# Altium schematic sheet Sheet1.SchDoc
size A1; SheetNumber: 1; SheetTotal: 1
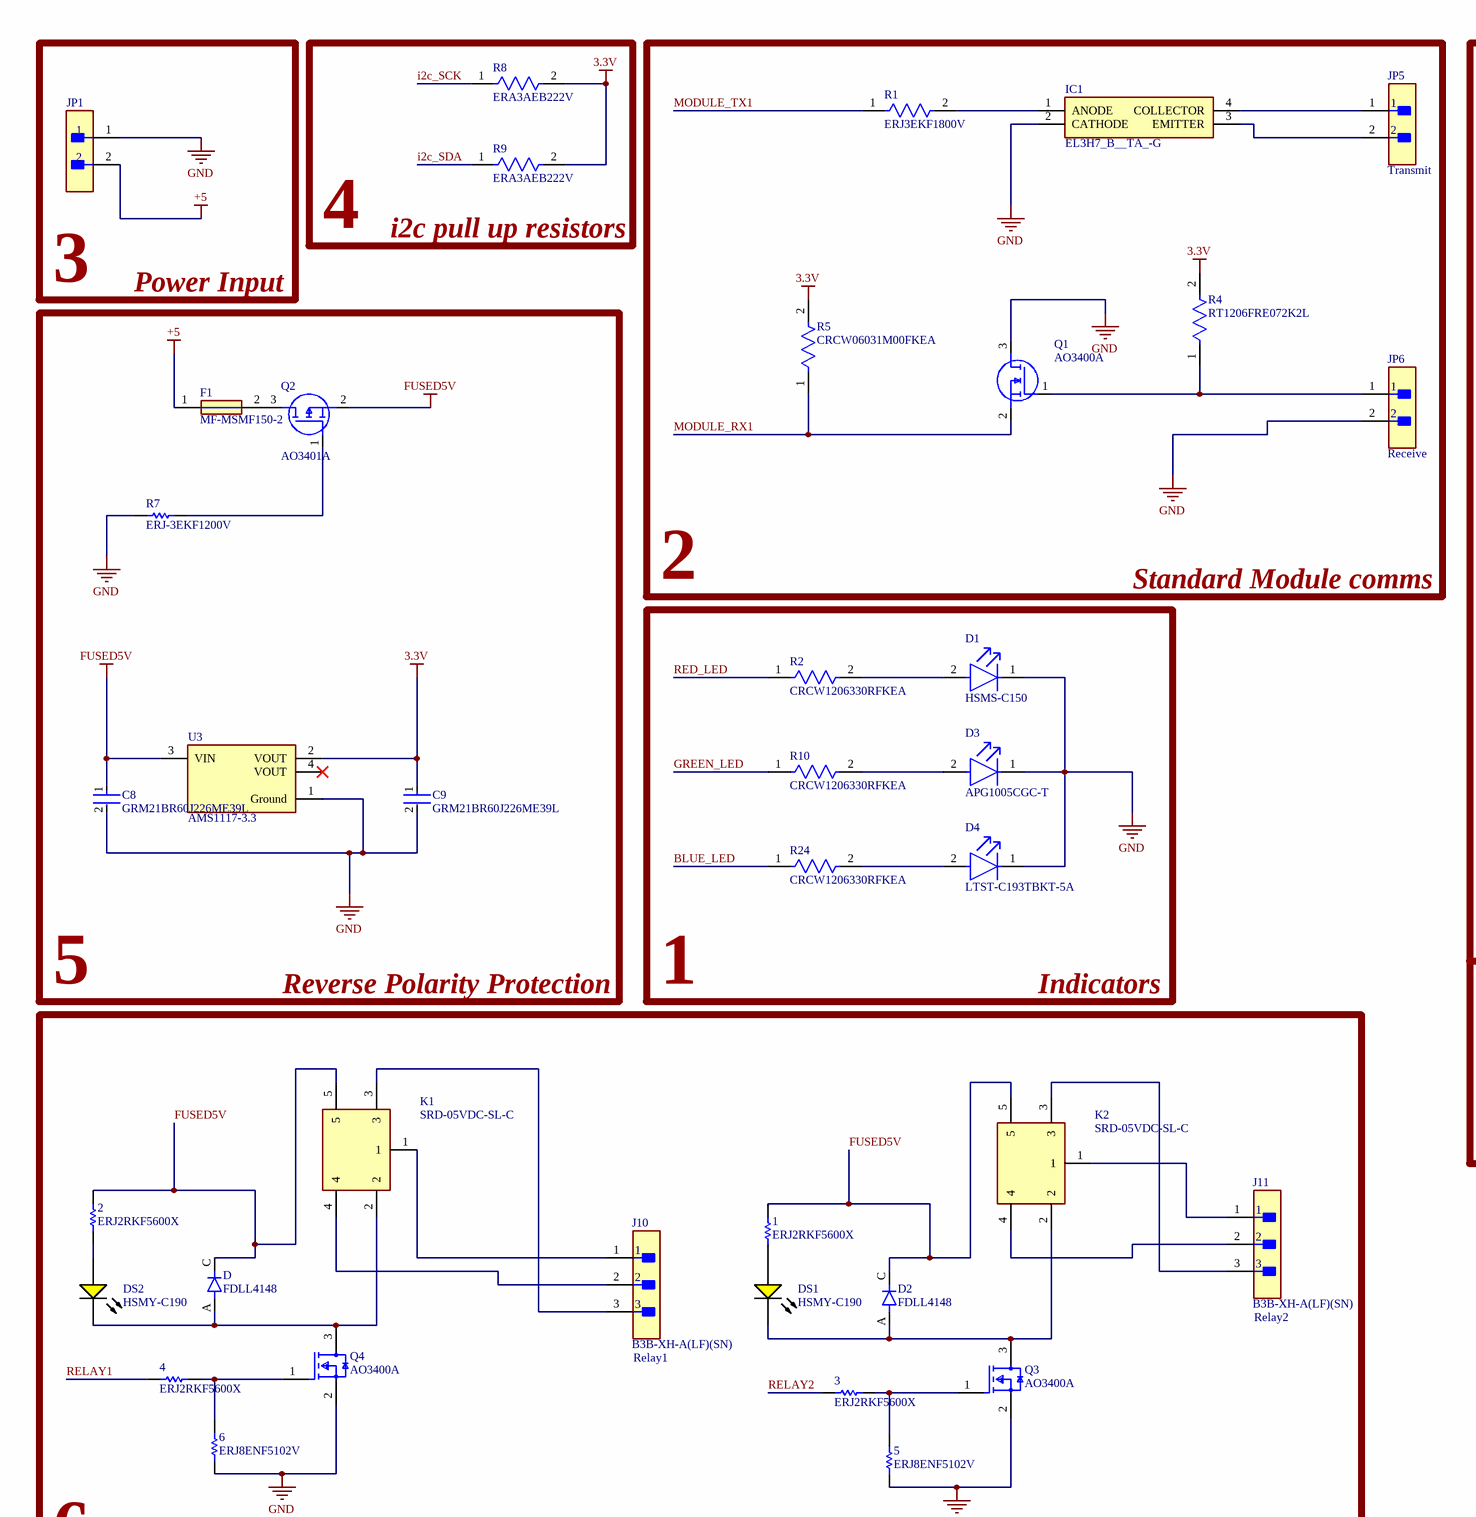
[diagram p0: Sheet1.SchDoc, top left]
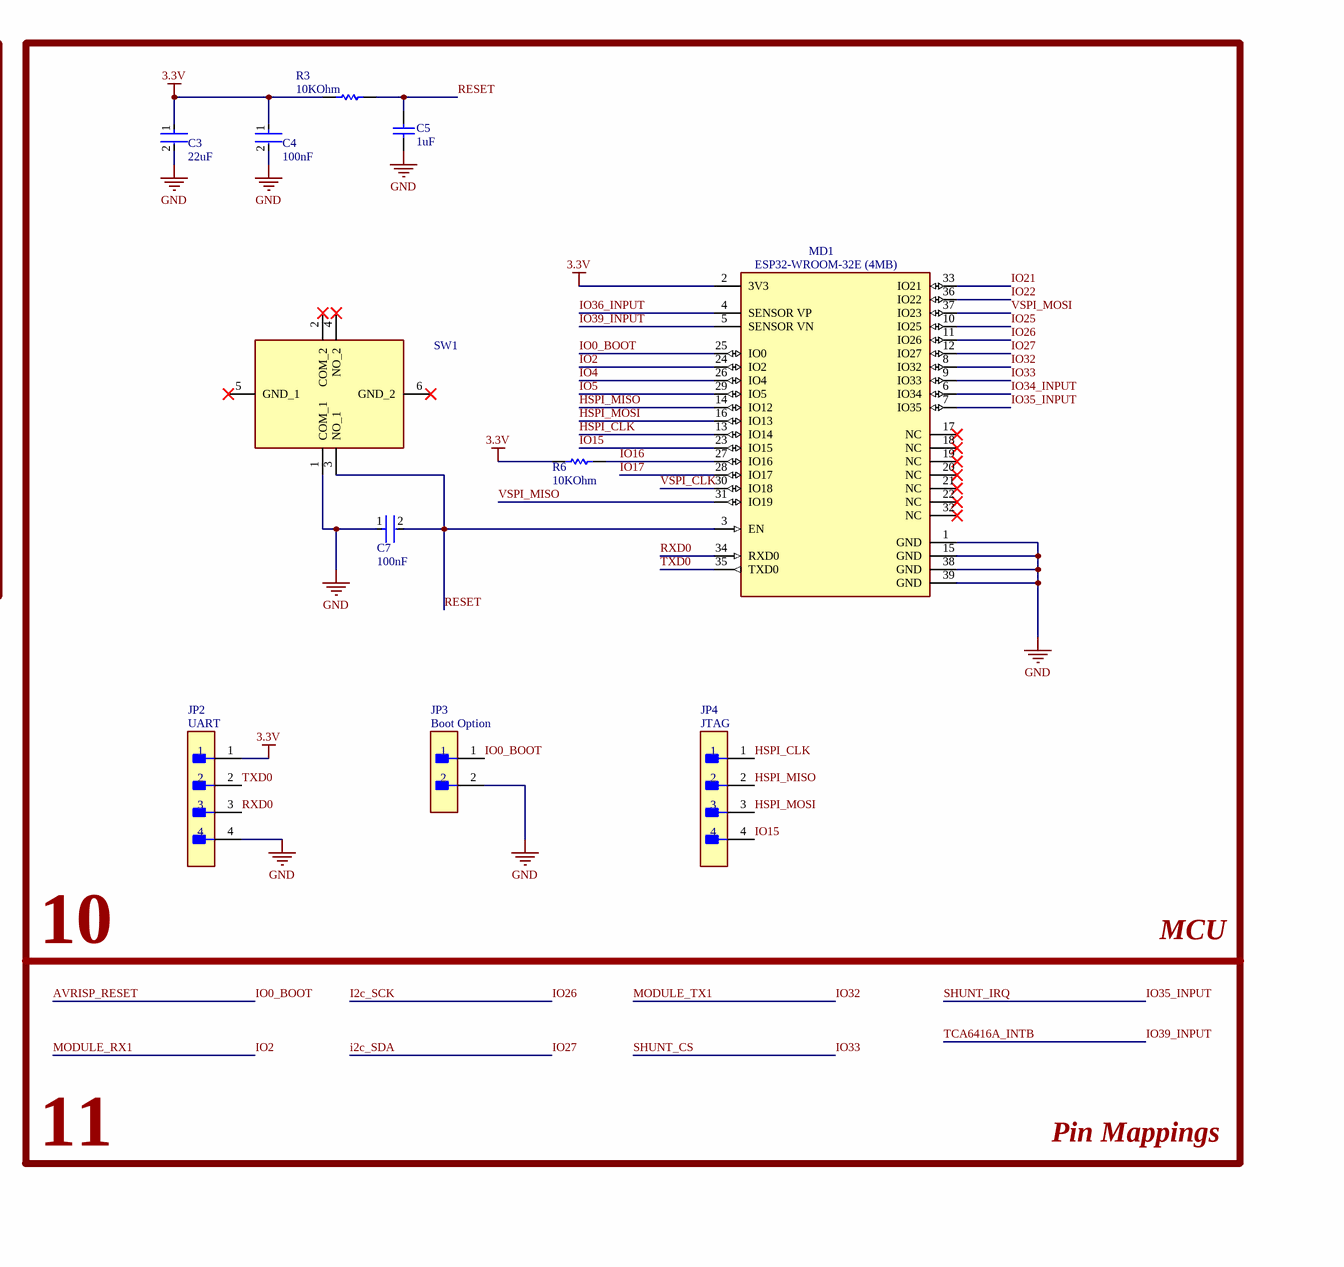
[diagram p1: Sheet1.SchDoc, top right]
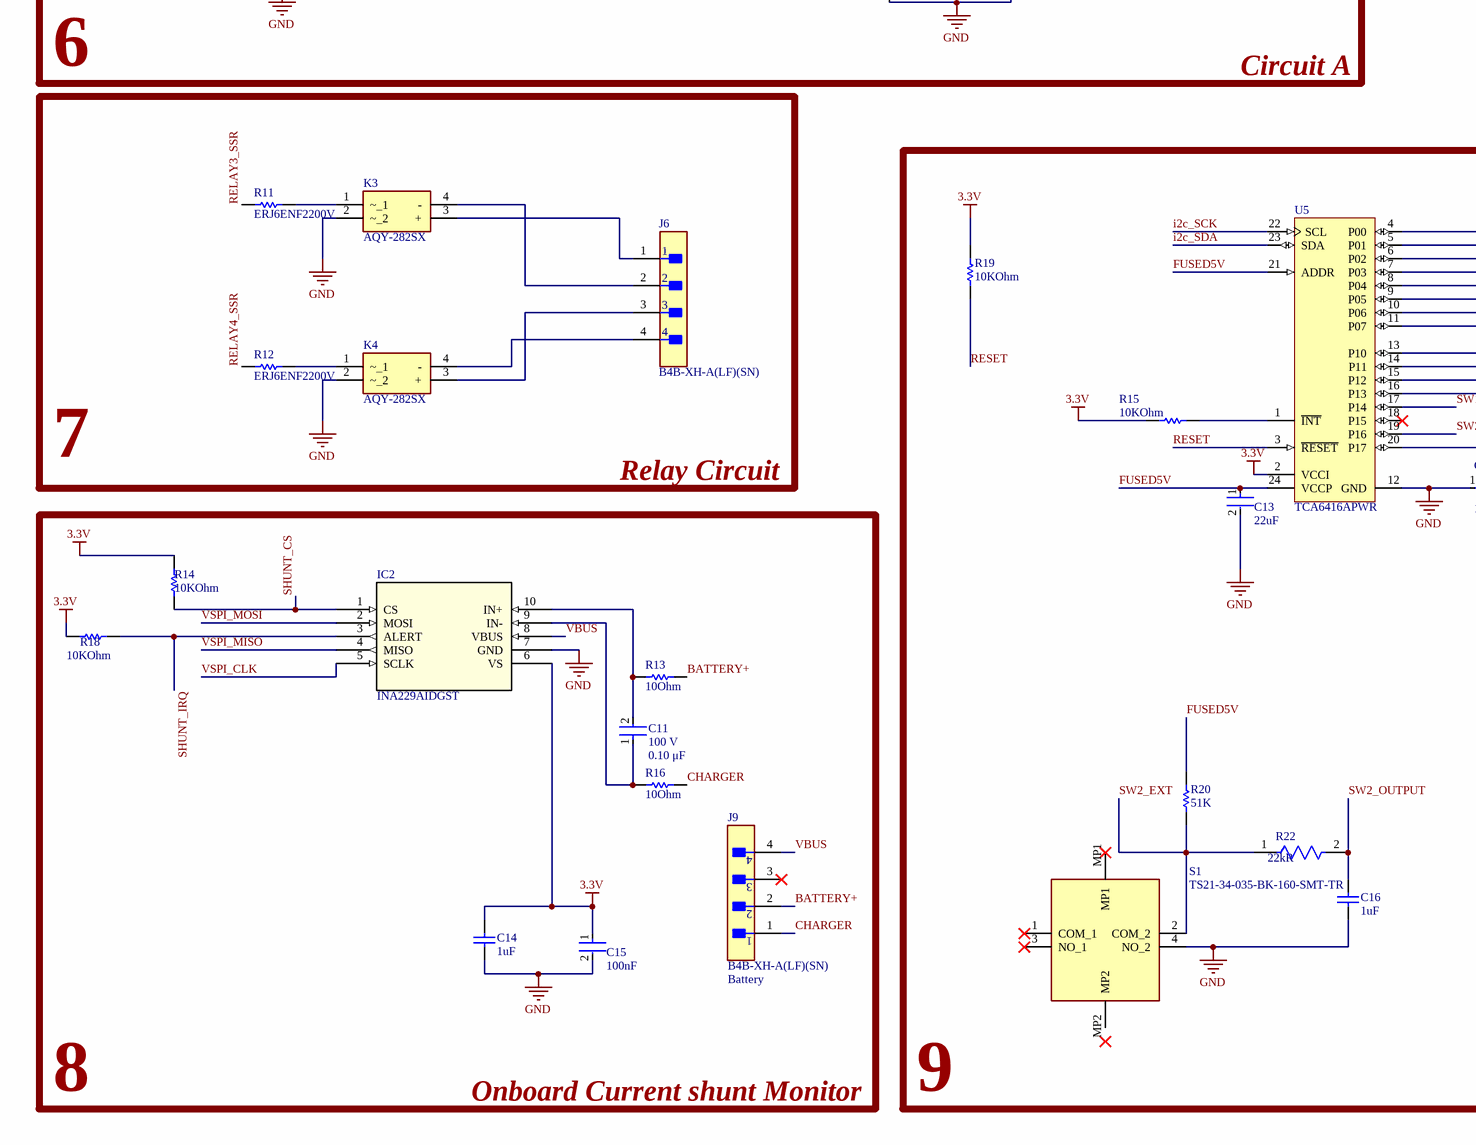
[diagram p2: Sheet1.SchDoc, bottom left]
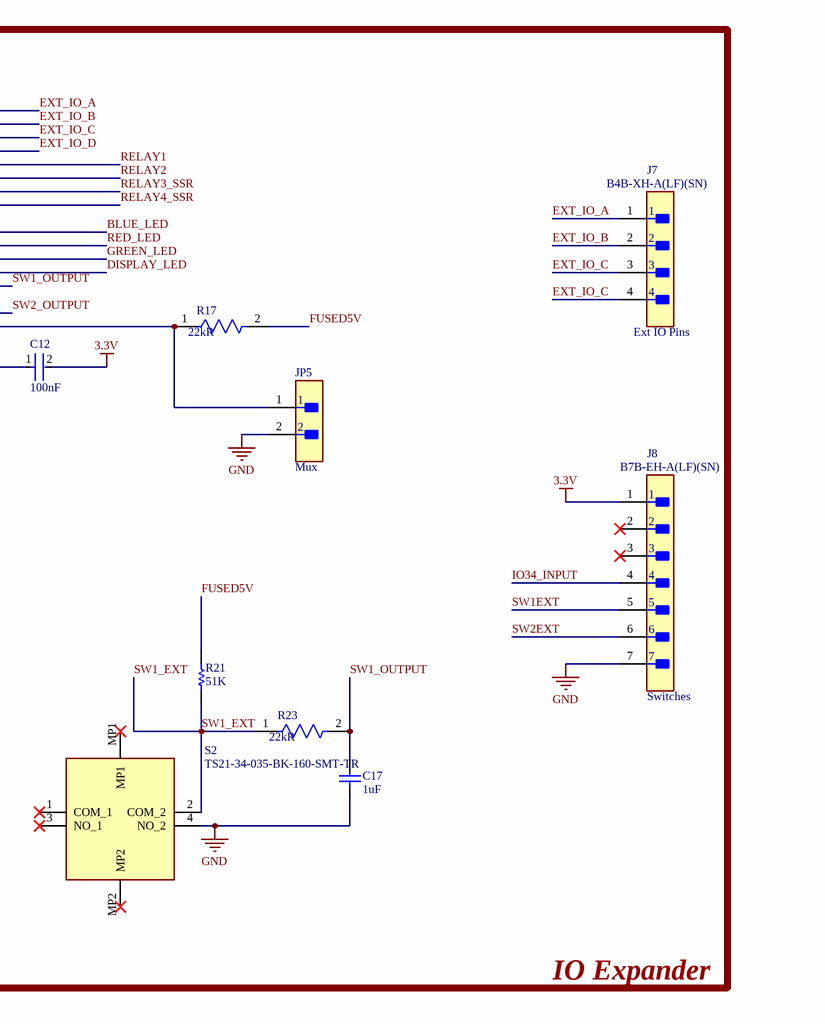
[diagram p3: Sheet1.SchDoc, bottom right]

## Parts
(Parts that share a designator on the sheet are numbered #1, #2 ... from top to bottom, then left to right.)
1  ERJ2RKF5600X  [RESC1005X40X25LL05T05]
2  ERJ2RKF5600X  [RESC1005X40X25LL05T05]
3  ERJ2RKF5600X  [RESC1005X40X25LL05T05]
4  ERJ2RKF5600X  [RESC1005X40X25LL05T05]
5  ERJ8ENF5102V  [RESC3216X70X50NL05T20]
6  ERJ8ENF5102V  [RESC3216X70X50NL05T20]
C3  Capacitance: 22uF  [FP-GRM21B-0_15-MFG]  (hidden comment: GRM21BR60J226ME39L)
C4  Capacitance: 100nF  [FP-GRM033-0_03-IPC_C]  (hidden comment: GRM033R61A104KE15D)
C5  Capacitance: 1uF  [CAPC2013X145X50LL20T25]  (hidden comment: C0805C105K4PACTU)
C7  Capacitance: 100nF  [FP-GRM033-0_03-IPC_C]  (hidden comment: GRM033R61A104KE15D)
C8  GRM21BR60J226ME39L  [FP-GRM21B-0_15-MFG]
C9  GRM21BR60J226ME39L  [FP-GRM21B-0_15-MFG]
C11  Voltage Rating: 100 V  Capacitance: 0.10 μF  [FP-C1206C-EB-MFG]  (hidden comment: C1206C104K1RACTU)
C12  Capacitance: 100nF  [FP-GRM033-0_03-IPC_C]  (hidden comment: GRM033R61A104KE15D)
C13  Capacitance: 22uF  [FP-GRM21B-0_15-MFG]  (hidden comment: GRM21BR60J226ME39L)
C14  Capacitance: 1uF  [CAPC2013X145X50LL20T25]  (hidden comment: C0805C105K4PACTU)
C15  Capacitance: 100nF  [FP-GRM033-0_03-IPC_C]  (hidden comment: GRM033R61A104KE15D)
C16  Capacitance: 1uF  [CAPC2013X145X50LL20T25]  (hidden comment: C0805C105K4PACTU)
C17  Capacitance: 1uF  [CAPC2013X145X50LL20T25]  (hidden comment: C0805C105K4PACTU)
D  FDLL4148  [DIOMELF3414N]
D1  HSMS-C150  [FP-HSMS-C150-MFG]
D2  FDLL4148  [DIOMELF3414N]
D3  APG1005CGC-T  [FP-APG1005CGC-T-MFG]
D4  LTST-C193TBKT-5A  [FP-LTST-C193TBKT-5A-MFG]
DS1  HSMY-C190  [AVAG-HSMX-C190_V]
DS2  HSMY-C190  [AVAG-HSMX-C190_V]
F1  MF-MSMF150-2  [FUSC4632X85N]
IC1  EL3H7_B__TA_-G  [SOIC127P700X200-4N]
IC2  INA229AIDGST  [VSSOP10_DGS_TEX]
J6  B4B-XH-A(LF)(SN)  [FP-B4B-XH-A_LF_SN-MFG]
J7  B4B-XH-A(LF)(SN)  [FP-B4B-XH-A_LF_SN-MFG]
J8  B7B-EH-A(LF)(SN)  [FP-B7B-EH-A_LF_SN-MFG]
J9  B4B-XH-A(LF)(SN)  [FP-B4B-XH-A_LF_SN-MFG]
J10  B3B-XH-A(LF)(SN)  [FP-B3B-XH-A_LF_SN-MFG]
J11  B3B-XH-A(LF)(SN)  [FP-B3B-XH-A_LF_SN-MFG]
JP1  B2B-XH-A(LF)(SN)  [FP-B2B-XH-A_LF_SN-MFG]  (value not drawn)
JP2  Purpose: UART  [FP-B4B-XH-A_LF_SN-MFG]  (hidden comment: B4B-XH-A(LF)(SN))
JP3  Purpose: Boot Option  [FP-B2B-XH-A_LF_SN-MFG]  (hidden comment: B2B-XH-A(LF)(SN))
JP4  Purpose: JTAG  [FP-B4B-XH-A_LF_SN-MFG]  (hidden comment: B4B-XH-A(LF)(SN))
JP5#1  Purpose: Transmit  [FP-B2B-XH-A_LF_SN-MFG]  (hidden comment: B2B-XH-A(LF)(SN))
JP5#2  Purpose: Mux  [FP-B2B-XH-A_LF_SN-MFG]  (hidden comment: B2B-XH-A(LF)(SN))
JP6  Purpose: Receive  [FP-B2B-XH-A_LF_SN-MFG]  (hidden comment: B2B-XH-A(LF)(SN))
K1  SRD-05VDC-SL-C  [SRD]
K2  SRD-05VDC-SL-C  [SRD]
K3  AQY-282SX  [SOP254P680X230-4N]
K4  AQY-282SX  [SOP254P680X230-4N]
MD1  ESP32-WROOM-32E (4MB)  [FP-ESP32-WROOM-32E_4MB-MFG]
Q1  AO3400A  [SOT95P280X125-3N]
Q2  AO3401A  [SOT95P280X125-3N]
Q3  AO3400A  [FP-SOT23-MFG]
Q4  AO3400A  [FP-SOT23-MFG]
R1  ERJ3EKF1800V  [FP-ERJ3EK-MFG]
R2  CRCW1206330RFKEA  [FP-CRCW1206-e3-MFG]
R3  Resistance: 10KOhm  [RESC1005X40X25LL05T05]  (hidden comment: ERJ2RKF1002X)
R4  RT1206FRE072K2L  [FP-RT1206-MFG]
R5  CRCW06031M00FKEA  [FP-CRCW0603-e3-IPC_A]
R6  Resistance: 10KOhm  [RESC1005X40X25LL05T05]  (hidden comment: ERJ2RKF1002X)
R7  ERJ-3EKF1200V  [RESC1609X55X30ML15T15]
R8  ERA3AEB222V  [FP-ERA3A-IPC_B]
R9  ERA3AEB222V  [FP-ERA3A-IPC_B]
R10  CRCW1206330RFKEA  [FP-CRCW1206-e3-MFG]
R11  ERJ6ENF2200V  [RESC2013X70X40NL20T20]
R12  ERJ6ENF2200V  [RESC2013X70X40NL20T20]
R13  Resistance: 10Ohm  [RESC3225X70X50LL20T20]  (hidden comment: ERJ-14NF10R0U)
R14  Resistance: 10KOhm  [RESC1005X40X25LL05T05]  (hidden comment: ERJ2RKF1002X)
R15  Resistance: 10KOhm  [RESC1005X40X25LL05T05]  (hidden comment: ERJ2RKF1002X)
R16  Resistance: 10Ohm  [RESC3225X70X50LL20T20]  (hidden comment: ERJ-14NF10R0U)
R17  Resistance: 22kR  [FP-ERA3A-MFG]  (hidden comment: ERA-3AEB223V)
R18  Resistance: 10KOhm  [RESC1005X40X25LL05T05]  (hidden comment: ERJ2RKF1002X)
R19  Resistance: 10KOhm  [RESC1005X40X25LL05T05]  (hidden comment: ERJ2RKF1002X)
R20  Resistance: 51K  [RESC1608X55X30NL15T15]  (hidden comment: ERJ-3GEYJ513V)
R21  Resistance: 51K  [RESC1608X55X30NL15T15]  (hidden comment: ERJ-3GEYJ513V)
R22  Resistance: 22kR  [FP-ERA3A-MFG]  (hidden comment: ERA-3AEB223V)
R23  Resistance: 22kR  [FP-ERA3A-MFG]  (hidden comment: ERA-3AEB223V)
R24  CRCW1206330RFKEA  [FP-CRCW1206-e3-MFG]
S1  TS21-34-035-BK-160-SMT-TR  [TS2134035BK160SMTTR]
S2  TS21-34-035-BK-160-SMT-TR  [TS2134035BK160SMTTR]
SW1  PTS526SMG20SMTR21_LFS  [PTS526SMG20SMTR21LFS]  (value not drawn)
U3  AMS1117-3.3  [FP-AMS1117-IPC_C]
U5  TCA6416APWR  [PW0024A_L]

## Blocks framed on the sheet
3: JP1
4: R8 R9
2: IC1 JP5#1 JP6 Q1 R1 R4 R5
5: C8 C9 F1 Q2 R7 U3
9: C12 C13 C16 C17 J7 J8 JP5#2 R15 R17 R19-R23 S1 S2 U5
8: C11 C14 C15 IC2 J9 R13 R14 R16 R18

## Nets
3.3V: C3.1 C4.1 C9.1 C12.2 C14.1 C15.1 IC2.6(VS) J8.1 JP2.1 MD1.2(3V3) R3.1 R4.2 R5.2 R6.1 R8.2 R9.2 R14.1 R15.1 R18.2 R19.2 U3.2(VOUT) U5.2(VCCI)
+5: F1.1 JP1.2
FUSED5V: 1.1 2.1 C8.1 C13.1 D.C D2.C K1.5 K2.5 Q2.2(S) R17.2 R20.2 R21.2 U3.3(VIN) U5.21(ADDR) U5.24(VCCP)
GND: 5.1 6.1 C3.2 C4.2 C5.1 C7.1 C8.2 C9.2 C12.1 C13.2 C14.2 C15.2 C16.2 C17.2 D1.1(C) D3.1(C) D4.1(C) IC1.2(CATHODE) IC2.7(GND) J8.7 JP1.1 JP2.4 JP3.2 JP5#2.2 JP6.2 K3.2(~_2) K4.2(~_2) MD1.1(GND) MD1.15(GND) MD1.38(GND) MD1.39(GND) Q1.3(D) Q3.2(S) Q4.2(S) R7.1 S1.4(NO_2) S2.4(NO_2) SW1.1(COM_1) U3.1(Ground) U5.12(GND)
AVRISP_RESET: JP3.1 MD1.25(IO0)  [also labelled IO0_BOOT]
BATTERY+: J9.2 R13.1
BLUE_LED: R24.1 U5.13(P10)
CHARGER: J9.1 R16.1
DISPLAY_LED: U5.16(P13)
EXT_IO_A: J7.1 U5.4(P00)
EXT_IO_B: J7.2 U5.5(P01)
EXT_IO_C: J7.3 J7.4 U5.6(P02)
EXT_IO_D: U5.7(P03)
GREEN_LED: R10.1 U5.15(P12)
HSPI_CLK: JP4.1 MD1.13(IO14)
HSPI_MISO: JP4.2 MD1.14(IO12)
HSPI_MOSI: JP4.3 MD1.16(IO13)
i2c_SCK: MD1.11(IO26) R8.1 U5.22(SCL)  [also labelled IO26]
i2c_SDA: MD1.12(IO27) R9.1 U5.23(SDA)  [also labelled IO27]
IO2: MD1.24(IO2) Q1.2(S) R5.1  [also labelled MODULE_RX1]
IO4: MD1.26(IO4)
IO5: MD1.29(IO5)
IO15: JP4.4 MD1.23(IO15)
IO16: MD1.27(IO16) R6.2
IO17: MD1.28(IO17)
IO21: MD1.33(IO21)
IO22: MD1.36(IO22)
IO25: MD1.10(IO25)
IO32: MD1.8(IO32) R1.1  [also labelled MODULE_TX1]
IO33: IC2.1(CS) MD1.9(IO33) R14.2  [also labelled SHUNT_CS]
IO34_INPUT: J8.4 MD1.6(IO34)
IO35_INPUT: IC2.3(ALERT) MD1.7(IO35) R18.1  [also labelled SHUNT_IRQ]
IO36_INPUT: MD1.4(SENSOR_VP)
IO39_INPUT: MD1.5(SENSOR_VN)  [also labelled TCA6416A_INTB]
RED_LED: R2.1 U5.14(P11)
RELAY1: 4.1 U5.8(P04)
RELAY2: 3.1 U5.9(P05)
RELAY3_SSR: R11.1 U5.10(P06)
RELAY4_SSR: R12.1 U5.11(P07)
RESET: C5.2 C7.2 MD1.3(EN) R3.2 R19.1 SW1.3(NO_1) U5.3(~{RESET})
RXD0: JP2.3 MD1.34(RXD0)
SW1_EXT: R21.1 R23.1 S2.2(COM_2)
SW1_OUTPUT: C17.1 R23.2 U5.17(P14)
SW1EXT: J8.5
SW2_EXT: R20.1 R22.1 S1.2(COM_2)
SW2_OUTPUT: C16.1 R22.2 U5.19(P16)
SW2EXT: J8.6
TXD0: JP2.2 MD1.35(TXD0)
VBUS: IC2.8(VBUS) J9.4
VSPI_CLK: IC2.5(SCLK) MD1.30(IO18)
VSPI_MISO: IC2.4(MISO) MD1.31(IO19)
VSPI_MOSI: IC2.2(MOSI) MD1.37(IO23)
Net1_2: 1.2 DS1.1(A)
Net2_2: 2.2 DS2.1(A)
Net3_2: 3.2 5.2 Q3.1(G)
Net4_2: 4.2 6.2 Q4.1(G)
NetC11_1: C11.1 IC2.9(IN-) R16.2
NetC11_2: C11.2 IC2.10(IN+) R13.2
NetD1_2: D1.2(A) R2.2
NetD2_A: D2.A DS1.2(K) K2.2 Q3.3(D)
NetD3_2: D3.2(A) R10.2
NetD4_2: D4.2(A) R24.2
NetD_A: D.A DS2.2(K) K1.2 Q4.3(D)
NetF1_2: F1.2 Q2.3(D)
NetIC1_1: IC1.1(ANODE) R1.2
NetIC1_3: IC1.3(EMITTER) JP5#1.2
NetIC1_4: IC1.4(COLLECTOR) JP5#1.1
NetJ6_1: J6.1 K3.3(+)
NetJ6_2: J6.2 K3.4(-)
NetJ6_3: J6.3 K4.3(+)
NetJ6_4: J6.4 K4.4(-)
NetJ10_1: J10.1 K1.1
NetJ10_2: J10.2 K1.4
NetJ10_3: J10.3 K1.3
NetJ11_1: J11.1 K2.1
NetJ11_2: J11.2 K2.4
NetJ11_3: J11.3 K2.3
NetJP5#2_1: JP5#2.1 R17.1 U5.20(P17)
NetJP6_1: JP6.1 Q1.1(G) R4.1
NetK3_1: K3.1(~_1) R11.2
NetK4_1: K4.1(~_1) R12.2
NetQ2_1: Q2.1(G) R7.2
NetR15_2: R15.2 U5.1(~{INT})

Not connected (* = marked no-connect by the designer): J8 2* 3*; J9 3*; MD1 17(NC)* 18(NC)* 19(NC)* 20(NC)* 21(NC)* 22(NC)* 32(NC)*; S1 1(COM_1)* 3(NO_1)* MP1* MP2; S2 1(COM_1)* 3(NO_1)* MP1* MP2*; SW1 2(COM_2)* 4(NO_2)* 5(GND_1)* 6(GND_2)*; U3 4(VOUT)*; U5 18(P15)*

## Notes on the sheet
- (near R9) i2c pull up resistors
- Power Input
- Standard Module comms
- MCU
- Reverse Polarity Protection
- 1
- Indicators
- 10
- Pin Mappings
- 11
- (near J11) Relay2
- (near J10) Relay1
- 6
- Circuit A
- 7
- (near J7) Ext IO Pins
- Relay Circuit
- (near J8) Switches
- (near J9) Battery
- Onboard Current shunt Monitor
- IO Expander

## Library data of the parts
1-4 = CMP-2002-01159-2: Chip Resistor, 560 Ohm, +/- 1%, 0.1 W, -55 to 155 degC, 0402 (1005 Metric), RoHS, Tape and Reel; Resistance: 560 Ohm; Voltage Rating: 50 V; Power Rating: 100 mW; Case\Package: 0402; Mounting Technology: Surface Mount; PackageDescription: 2-Pin Surface Mount Device, Body 1 x 0.5 mm; RoHSCompliant: true; ComponentLink1URL: http://www.panasonic.com/; Tolerance: 1%; REACH SVHC: Yes; Height: 0.35 mm; ComponentLink2Description: Datasheet; ComponentLink2URL: http://industrial.panasonic.com/cdbs/www-data/pdf/RDA0000/AOA0000C86.pdf; Radiation Hardening: No; Pins: 2; DatasheetVersion: 04/2015; Min Operating Temperature: -55 degC; Length: 1 mm; Case Code (Imperial): 0402; Packaging: Tape and Reel; Max Operating Temperature: 155 degC; ComponentLink1Description: Manufacturer URL; Mount: Surface Mount; Width: 0.5 mm; Case Code (Metric): 1005; Package Quantity: 10000; PackageReference: 0402
5 6 = CMP-2003-00854-1: Manufacturer: Panasonic; Part Number: ERJ8ENF5102V
C3 C8 C9 C13 = CMP-2007-03385-2: Chip Multilayer Ceramic Capacitors for General Purpose, 0805, 22uF, X5R, 15%, 20%, 6.3V; Material: Ceramic; Max Operating Temperature: 85°C; Voltage: 6.3V; Min Operating Temperature: -55°C; Case/Package: 0805; Thickness: 0.053inch; Dielectric: X5R; Packaging: Tape and Reel; Depth: 1.25mm; Termination: SMD/SMT; Voltage Rating (DC): 6.3V; Radiation Hardening: No; Tolerance: 20%; Mount: Surface Mount; Lead Free: Lead Free; Package Quantity: 1; REACH SVHC: No SVHC; Voltage Rating: 6.3V; Length: 2mm; Case Code (Imperial): 0805; Case Code (Metric): 2012; Width: 0.049inch; Height: 1.25mm
  C8 C9: Capacitance: 22uF
C4 C7 C12 C15 = CMP-2010-01264-2: Chip Multilayer Ceramic Capacitors for General Purpose, 0201, 0.10uF, X5R, 15%, 10%, 10V; Mount: Surface Mount; Dielectric: X5R; Width: 0.012inch; Tolerance: 10%; Radiation Hardening: No; Voltage Rating: 10V; REACH SVHC: No SVHC; Height: 0.3mm; Max Operating Temperature: 85°C; Voltage Rating (DC): 10V; Thickness: 0.013inch; Termination: SMD/SMT; Lead Free: Lead Free; Package Quantity: 1; Case/Package: 0201; Min Operating Temperature: -55°C; Weight: 6E-06oz; Length: 0.6mm; Case Code (Imperial): 0201; Depth: 0.3mm; Voltage: 10V; Packaging: Tape and Reel; Case Code (Metric): 0603
C5 C14 C16 C17 = CMP-1036-04746-2: Manufacturer: Kemet; Part Number: C0805C105K4PACTU
C11 = CMP-03020-000153-1: CAP CER 0.1UF 100V X7R 1206; Manufacturer: KEMET; Value: 0.10 μF; Tolerance: 0.1; Material: Ceramic; Temperature Coefficient: 15%; Automotive Grade: Grade 0; Automotive: Yes; Ipc Land Pattern Name: CAPC320160X78; Device Class L1: Passive Components; ComponentLink2Description: Datasheet; Temperature Range Low: -55°C; Category: Cap; Octopart: https://octopart.com/c1206c104k1ractu-kemet-89521; Height: 0.88mm; Lead Free: Yes; Digikey Description: CAP CER 0.1UF 100V X7R 1206; Mouser Description: CAP CER 0.1UF 100V X7R 1206; Device Class L3: Ceramic Capacitors; Device Class L2: Capacitors; ComponentLink2URL: https://content.kemet.com/datasheets/KEM_C1007_X8R_ULTRA_150C_SMD.pdf; Temperature Range High: +150°C; Temperature Characteristic: X7R; Manufacturer Part Number: C1206C104K1RACTU; RoHS: TRUE; Package: C1206C-EB; Temperature: -55°C to +150°C
D D2 = FDLL4148: Diode Standard 100V 200mA Surface Mount SOD-80; MF: ON Semiconductor; MP: FDLL4148; SnapEDA_Link: https://www.snapeda.com/parts/FDLL4148/ON%20Semiconductor/view-part/2783433/?ref=snap; Package: SOD-80-2 ON Semiconductor; DigiKey-Purchase-URL: https://snapeda.com/shop?store=DigiKey&id=2783433; Value: *; Mouser-Purchase-URL: https://snapeda.com/shop?store=Mouser&id=2783433; Digi-Key_Part_Number: FDLL4148CT-ND; Check_prices: https://www.snapeda.com/parts/FDLL4148/ON%20Semiconductor/view-part/2783433/?ref=eda
D1 = CMP-21615-000001-1: LED RED DIFFUSED CHIP SMD; Luminous Intensity: 10mcd; Power Dissipation: 65mW; Viewing Angle: 170°; Number of Elements: 1; Forward Current: 20mA; Lens Color: White; Lens Style: Rectangular; Wavelength: 626nm; Forward Voltage: 2.1V; Reverse Voltage: 5V; Number of Pins: 2; Color: Red; Lead Free: Lead Free; Width: 1.6mm; Length: 3.2mm; REACH SVHC: No SVHC; Height: 1.1mm; Depth: 1.6mm; Power Rating: 65mW; Package Quantity: 1; Illumination Color: Red; Radiation Hardening: No; Case Code (Imperial): 1206; Max Operating Temperature: 85°C; Test Current: 20mA; Case/Package: 1206; Lens Transparency: Diffused; Number of LEDs: 1; Packaging: Tape and Reel; Mount: Surface Mount; Min Operating Temperature: -40°C; Case Code (Metric): 3216; Dominant Wavelength: 626nm
D3 = CMP-44529-000029-1: LED GREEN CLEAR CHIP SMD; Forward Voltage: 2V; Lens Color: Colorless; Test Current: 20mA; Dominant Wavelength: 571nm; Viewing Angle: 120°; Luminous Intensity: 35mcd; Width: 0.5mm; Case Code (Imperial): 0402; Color: Green; Package Quantity: 1; Case/Package: 0402; Packaging: Tape and Reel; Height: 0.25mm; Mount: Surface Mount; Case Code (Metric): 1005; Length: 1mm; Lead Free: Lead Free; Lens Transparency: Clear
D4 = CMP-2000-06624-2: LED BLUE CLEAR CHIP SMD; Number of Elements: 1; Forward Voltage: 2.8V; Forward Current: 20mA; Test Current: 5mA; Lens Color: Colorless; Dominant Wavelength: 475nm; Reverse Voltage: 5V; Viewing Angle: 130°; Lens Style: Diffused; Luminous Intensity: 15mcd; Power Dissipation: 76mW; Max Operating Temperature: 80°C; Length: 1.6mm; Number of LEDs: 1; Case/Package: 0603; Case Code (Metric): 1608; Number of Pins: 2; Radiation Hardening: No; Min Operating Temperature: -20°C; Width: 0.8mm; Packaging: Tape and Reel; Package Quantity: 1; Lead Free: Lead Free; Lens Transparency: Clear; Illumination Color: Blue; Color: Blue; RoHS Compliant: Yes; Mount: Surface Mount; Depth: 0.8mm; Case Code (Imperial): 0603; Height: 0.35mm
DS1 DS2 = CMP-1744-00003-1: LED Uni-Color Yellow, 65 mW, 20 mA, -40 to 85 degC, 2-Pin SMD, RoHS, Tape and Reel; Tolerance: 1%; Voltage Rating: 50 V; Power Rating: 100 mW; Case\Package: 0603; Resistance: 390 Ohm; Min Operating Temperature: -55 degC; Length: 1.6 mm; ComponentLink3Description: Package Specification; Mount: Surface Mount; PackageReference: HSMX-C190; ComponentLink2Description: Datasheet; DatasheetVersion: Mar-12; Case Code (Metric): 1608; Pins: 2; Package Quantity: 5000; ComponentLink2URL: http://docs.avagotech.com/docs/AV02-0551EN; ComponentLink1Description: Manufacturer URL; RoHSCompliant: true; Packaging: Tape and Reel; PackageDescription: 2-Pin Surface Mount Device, Body 1.6 x 0.8 mm, Height 0.9 mm; REACH SVHC: No SVHC; ComponentLink3URL: http://www.fairchildsemi.com/dwg/MA/MA03D.pdf; Voltage Rating (DC): 50 V; Width: 0.8 mm; ComponentLink1URL: http://www.avagotech.com/; Max Operating Temperature: 155 degC; Case Code (Imperial): 0603; Height: 0.45 mm
F1 = MF-MSMF150-2: Fuse; Manufacturer_Name: Bourns; Datasheet Link: https://componentsearchengine.com/Datasheets/2/MF-MSMF150-2.pdf; Height: 0.85mm; Manufacturer_Part_Number: MF-MSMF150-2; Mouser Part Number: 652-MF-MSMF150-2; Mouser Price/Stock: https://www.mouser.co.uk/ProductDetail/Bourns/MF-MSMF150-2?qs=VJkZAnU6DY2RTCSZT8Bxqg%3D%3D; Arrow Part Number: MF-MSMF150-2; Arrow Price/Stock: https://www.arrow.com/en/products/mf-msmf150-2/bourns?region=nac
IC1 = EL3H7_B__TA_-G: Integrated Circuit; Manufacturer_Name: Everlight; Manufacturer_Part_Number: EL3H7(B)(TA)-G; Datasheet Link: https://www.arrow.com/en/products/el3h7-b-ta-g/everlight-electronics?region=nac; Height: 2mm; Mouser Part Number: 638-EL3H7BTAG; Mouser Price/Stock: https://www.mouser.co.uk/ProductDetail/Everlight/EL3H7BTA-G?qs=8PzhAHr7IdM%252B0XGOXhFFCg%3D%3D; Arrow Part Number: EL3H7(B)(TA)-G; Arrow Price/Stock: https://www.arrow.com/en/products/el3h7-b-ta-g/everlight-electronics?region=nac
IC2 = INA229AIDGST: No Description Available; Mfr_Name: Texas Instruments; Type: Linear; RefDes: RefDes
J6 J7 J9 JP2 JP4 = CMP-17439-000250-1: CONN HEADER VERT 4POS 2.5MM; Number of Contacts: 4; Contact Resistance: 20mR; Voltage Rating: 250V; Max Current Rating: 3A; Gender: Male; Wire/Cable Gauge: 22AWG; Mated Stacking Heights: 9.8mm; Insulation Resistance: 1GR; Orientation: Straight; Contact Type: Male Pin; Contact Finish - Mating: TIN; Series: XH; Max Voltage Rating (AC): 250V; Lead Pitch: 2.5mm; Contact Shape: Square; Insulation Color: Natural; Termination: Solder; Lead Free: Lead Free; Voltage Rating (AC): 250V; Number of Rows: 1; Flammability Rating: UL94 V-0; Number of Positions: 4; Max Operating Temperature: 85°C; Package Quantity: 500; Mount: Through Hole; REACH SVHC: No SVHC; Connector Type: Header; Insulation Material: Nylon; Fastening Type: Detent; Min Operating Temperature: -25°C; Housing Color: White; Packaging: Bulk; Contact Plating: Tin; Contact Material: Brass; Max Voltage Rating (DC): 250V; Housing Material: Polyamide; Color: Natural; Material: Polyamide; Pitch: 2.5mm; Depth: 5.75mm; Current Rating: 3A; Length: 12.4mm
J8 = CMP-17439-000532-1: CONN HEADER VERT 7POS 2.5MM; Number of Contacts: 7; Mated Stacking Heights: 8.1mm; Gender: Male; Current Rating: 3A; Voltage Rating: 250V; Termination: Solder; Contact Material: Brass; Connector Type: Header; Flammability Rating: UL94 V-0; Housing Material: Nylon; Series: EH; Fastening Type: Friction; Lead Free: Lead Free; Insulation Color: Natural; Contact Type: Male Pin; Number of Rows: 1; Packaging: Bulk; Color: Natural; Contact Finish - Mating: TIN; Orientation: Straight; Contact Shape: Square; Contact Plating: Tin; Insulation Material: Nylon; Housing Color: White; Mount: Through Hole; Contact Mating Length: 0.13inch; Pitch: 2.5mm; Number of Positions: 7
J10 J11 = CMP-17439-000014-3: CONN HEADER VERT 3POS 2.5MM; Max Voltage Rating (DC): 250V; Number of Positions: 3; Current Rating: 3A; Gender: Male; Wire/Cable Gauge: 22AWG; Contact Resistance: 20mR; Insulation Resistance: 1GR; Insulation Material: Nylon; Contact Plating: Tin; Depth: 5.75mm; Contact Type: Male Pin; Max Operating Temperature: 85°C; Insulation Color: Natural; Voltage Rating (AC): 250V; Color: Natural; Connector Type: Header; Orientation: Straight; Fastening Type: Detent; Housing Color: White; Min Operating Temperature: -25°C; Termination: Solder; Voltage Rating: 250V; Series: XH; Pitch: 2.5mm; Contact Shape: Square; Number of Rows: 1; Lead Free: Lead Free; Packaging: Bulk; Mount: Through Hole; Flammability Rating: UL94 V-0; Max Voltage Rating (AC): 250V; REACH SVHC: No SVHC; Housing Material: Polyamide; Contact Material: Brass; Lead Pitch: 2.5mm; Contact Finish - Mating: TIN; Length: 9.9mm; Max Current Rating: 3A; Number of Contacts: 3
JP1 JP3 JP5#1 JP5#2 JP6 = CMP-2000-05888-3: CONN HEADER VERT 2POS 2.5MM; Current Rating: 3A; Voltage Rating: 250V; Number of Contacts: 2; Contact Resistance: 20mR; Wire/Cable Gauge: 22AWG; Insulation Resistance: 1GR; Connector Type: Male Pin; Packaging: Bulk; Contact Material: Brass; Lead Free: Lead Free; Orientation: Straight; Contact Plating: Tin; Max Current Rating: 3A; Termination: Solder; Fastening Type: Detent; Depth: 5.75mm; Housing Material: Polyamide; REACH SVHC: No SVHC; Series: XH; Voltage Rating (AC): 250V; Number of Positions: 2; Color: Natural; Contact Type: Male Pin; Max Voltage Rating (DC): 250V; Pitch: 2.5mm; Lead Pitch: 2.5mm; Mount: Through Hole; Max Operating Temperature: 85°C; Length: 7.4mm; Max Voltage Rating (AC): 250V; Min Operating Temperature: -25°C; Number of Rows: 1; Housing Color: White
K1 K2 = SRD-05VDC-SL-C: Relay or Contactor; Manufacturer_Name: Songle Relay; Datasheet Link: http://files.microjpm.webnode.com/200001010-dda41de9e1/Songle%20Relay%20Datasheet.pdf; Manufacturer_Part_Number: SRD-05VDC-SL-C
K3 K4 = AQY-282SX: Relay or Contactor; Manufacturer_Name: Panasonic; Datasheet Link: https://componentsearchengine.com/Datasheets/2/AQY282SX.pdf; Height: 2.3mm; Manufacturer_Part_Number: AQY-282SX
MD1 = CMP-194065-000026-1: RX TXRX MOD WIFI TRACE ANT SMD
Q1 = AO3400A: MOSFET (N-Channel); Manufacturer_Name: Alpha & Omega Semiconductors; Datasheet Link: http://aosmd.com/res/data_sheets/AO3400A.pdf; Height: 1.25mm; Manufacturer_Part_Number: AO3400A; Arrow Part Number: AO3400A; Arrow Price/Stock: https://www.arrow.com/en/products/ao3400a/alpha-and-omega-semiconductor?region=europe
Q2 = AO3401A: MOSFET (P-Channel); Manufacturer_Name: Alpha & Omega Semiconductors; Datasheet Link: http://www.aosmd.com/pdfs/datasheet/AO3401A.pdf; Height: 1.25mm; Manufacturer_Part_Number: AO3401A; Arrow Part Number: AO3401A; Arrow Price/Stock: https://www.arrow.com/en/products/ao3401a/alpha-and-omega-semiconductor?region=nac
Q3 Q4 = CMP-83955-000006-1: MOSFET N-CH 30V 5.7A SOT23; Input Capacitance: 630pF; Number of Elements: 1; Rds On Max: 26.5mR; Max Power Dissipation: 1.4W; Gate to Source Voltage (Vgs): 12V; Min Operating Temperature: -55°C; Lead Free: Lead Free; Number of Pins: 3; Drain to Source Voltage (Vdss): 30V; Case/Package: SOT-23; Mount: Surface Mount; Continuous Drain Current (ID): 5.7A; Radiation Hardening: No; Packaging: Tape and Reel; Max Operating Temperature: 150°C; Power Dissipation: 1.4W
R1 = CMP-2000-00293-2: RES SMD 180 OHM 1% 1/10W 0603; Manufacturer: Panasonic; Value: 180Ω; Power Rating: 0.1W; Temperature Coefficient: 100ppm/°C; Voltage Rating: 75V; Automotive Grade: Grade 0; Digikey Description: RES SMD 180 OHM 1% 1/10W 0603; Series: ERJ; Octopart: https://octopart.com/erj-3ekf1800v-panasonic-55421532; Footprint Url: https://industrial.panasonic.com/cdbs/www-data/pdf/RDA0000/DMA0000COL17.pdf; Temperature: -55°C to +155°C; ComponentLink2Description: Datasheet; Device Class L3: Chip SMD Resistors; Temperature Range High: +155°C; RoHS: TRUE; Category: Res; Device Class L2: Resistors; Package: ERJ3EK; Mouser Description: Thick Film Resistors 0603 180ohms 1% AEC-Q200; Manufacturer Part Number: ERJ3EKF1800V; Resistance: 180Ω; Temperature Range Low: -55°C; Device Class L1: Passive Components; Automotive: Yes; ComponentLink2URL: https://industrial.panasonic.com/cdbs/www-data/pdf/RDA0000/AOA0000C304.pdf; Tolerance: 1%; Lead Free: Yes; Composition: Thick Film; Height: 0.55mm
R2 R10 R24 = CMP-2003-02098-2: RES Thick Film, 330Ω, 1%, 0.25W, 100ppm/°C, 1206; Voltage Rating: 200V; Resistance: 330R; Max Power Dissipation: 250mW; Height: 0.55mm; Mount: Surface Mount; Min Operating Temperature: -55°C; Depth: 1.6mm; Features: Automotive AEC-Q200; Voltage Rating (DC): 200V; Military Standard: Not; Packaging: Tape and Reel; Composition: Thick Film; Contact Plating: Tin; Case Code (Imperial): 1206; Case/Package: 1206; Number of Terminations: 2; Length: 3.2mm; Lead Free: Lead Free; Tolerance: 1%; Temperature Coefficient: 100ppm/°C; Case Code (Metric): 3216; Width: 1.6mm; Weight: 0.000353oz; Termination: SMD/SMT; Radiation Hardening: No; Package Quantity: 10; Power Rating: 250mW; Max Operating Temperature: 155°C
R3 R6 R14 R15 R18 R19 = CMP-2000-07588-1: Chip Resistor, 10 KOhm, +/- 1%, 0.1 W, -55 to 155 degC, 0402 (1005 Metric), RoHS, Tape and Reel; Manufacturer: Panasonic; Power Rating: 100mW; Voltage Rating: 50V; Case\/Package: 0402; Temperature Coefficient: 100ppm\/degreesC; RoHSCompliant: True; Lead Free: LeadFree; Package Quantity: 1; Contact Plating: Tin; Length: 1mm; Radiation Hardening: No; REACH SVHC: NoSVHC; Max Operating Temperature: 155degC; Depth: 0.5mm; Case Code (Imperial): 0402; Military Standard: Not; Package Description: 2-Pin Surface Mount Device, Body 1 x 0.5 mm; Termination: SMD/SMT; Case Code (Metric): 1005; Height: 0.35mm; Packaging: TapeandReel; Voltage Rating (DC): 50V; Package Reference: 402; Number of Pins: 2; Tolerance: 1%; Mounting Technology: SurfaceMount; Width: 0.02inch; Mount: SurfaceMount; Datasheet URL: https://industrial.panasonic.com/cdbs/www-data/pdf/RDA0000/AOA0000C304.pdf; Composition: ThickFilm; Datasheet Version: 02/2017; Manufacturer URL: http://www.panasonic.com/; Max Power Dissipation: 100mW; Number of Terminations: 2; Min Operating Temperature: -55degC
R4 = CMP-2003-04309-2: RES SMD 2.2K OHM 1% 1/4W 1206; Manufacturer: Yageo; Power Rating: 0.25W; Resistance: 2.2KΩ; Tolerance: 0.0002; Temperature Coefficient: 50 ppm/°C; Value: 2.2KΩ; Voltage Rating: 200V; Device Class L3: Chip SMD Resistors; Temperature: -55°C to +155°C; Digikey Description: RES SMD 2.2K OHM 1% 1/4W 1206; Height: 0.65mm; Manufacturer Part Number: RT1206FRE072K2L; ComponentLink2URL: http://www.yageo.com/documents/recent/PYu-RT_1-to-0.01_RoHS_L_9.pdf; Device Class L1: Passive Components; Ipc Land Pattern Name: RESC310160X55; Octopart: https://octopart.com/rt1206fre072k2l-yageo-1275907; Device Class L2: Resistors; Series: RT; Automotive: No; Temperature Range Low: -55°C; RoHS: TRUE; Category: Res; Temperature Range High: +155°C; ComponentLink2Description: Datasheet; Package: RT1206; Lead Free: Yes; Footprint Url: http://www.yageo.com/exep/pages/download/literatures/PYu-R_Mount_10.pdf; Mouser Description: High Precision-High Stability Chip Resistor Thin Film 1206 2.2kOhm 1% Paper T/R; Composition: Thin Film
R5 = CMP-2000-03013-2: RES Thick Film, 1MΩ, 1%, 0.1W, 100ppm/°C, 0603; Max Power Dissipation: 100mW; Resistance: 1MR; Voltage Rating (DC): 75V; Depth: 0.85mm; Max Operating Temperature: 155°C; Length: 1.55mm; Power Rating: 100mW; Military Standard: Not; Features: Automotive AEC-Q200; Min Operating Temperature: -55°C; Number of Pins: 2; Mount: Surface Mount; Package Quantity: 10; Packaging: Tape and Reel; Height: 0.45mm; Radiation Hardening: No; Case Code (Metric): 1608; Temperature Coefficient: 100ppm/°C; Width: 0.85mm; Composition: Thick Film; Termination: SMD/SMT; Tolerance: 1%; Number of Terminations: 2; Lead Free: Lead Free; Contact Plating: Tin; Case/Package: 0603; Weight: 7.1E-05oz; Voltage Rating: 75V; Case Code (Imperial): 0603
R7 = CMP-2000-00213-2: Chip Resistor, 120 Ohm, +/- 1%, 0.1 W, -55 to 155 degC, 0603 (1608 Metric), RoHS, Tape and Reel; Manufacturer: Panasonic; Power Rating: 100mW; Voltage Rating (DC): 75V; Resistance: 120Ohm; Temperature Coefficient: 100ppm/degreesC; Number of Terminations: 2; Military Standard: Not; Tolerance: 1%; Min Operating Temperature: -55degC; Packaging: TapeandReel; Lead Free: LeadFree; Max Operating Temperature: 155degC; Manufacturer URL: http://www.panasonic.com/; Case Code (Imperial): 0603; REACH SVHC: NoSVHC; Width: 0.031inch; Datasheet URL: https://industrial.panasonic.com/cdbs/www-data/pdf/RDA0000/AOA0000C283.pdf; RoHSCompliant: true; Max Power Dissipation: 100mW; Termination: SMD/SMT; Package Reference: 0603; Height: 0.022inch; Depth: 0.8mm; Package Description: 2-Pin Surface Mount Device, Body 1.6 x 0.85 mm; Contact Plating: Tin; Length: 1.6mm; Package URL: http://www.st.com/st-web-ui/static/active/en/resource/technical/document/datasheet/CD00001320.pdf; Radiation Hardening: No; Package Quantity: 1; Number of Pins: 2; Datasheet Version: 42095.0; Voltage Rating: 75V; Composition: ThickFilm; Case/Package: 0603; Mount: SurfaceMount; Case Code (Metric): 1608
R8 R9 = CMP-2000-00955-7: RES SMD 2.2K OHM 0.1% 1/10W 0603; Power Rating: 100mW; Resistance: 2.2kR; Voltage Rating (DC): 75V; Temperature Coefficient: 25ppm/°C; Case/Package: 0603; Number of Pins: 2; Length: 1.6mm; Width: 0.8mm; RoHS Compliant: Yes; Lead Free: Lead Free; Radiation Hardening: No; Mount: Surface Mount; Max Power Dissipation: 100mW; Package Quantity: 5000; Height: 0.45mm; Series: ERA-3A; Reach SVHC Compliant: Yes; Features: Automotive AEC-Q200; Case Code (Imperial): 0603; Packaging: Tape and Reel; Construction: Rectangular; Case Code (Metric): 1608; Technology: METAL FILM; Ratings: AEC-Q200; Termination: SMD/SMT; Max Operating Temperature: 155°C; Depth: 0.8mm; Resistor Type: Thin Film; Tolerance: 0.1%; Military Standard: Not; Resistance Tolerance: 0.1%; Contact Plating: Tin; Number of Terminations: 2; Min Operating Temperature: -55°C; Size Code: 0603; Voltage Rating: 75V
R11 R12 = CMP-2001-00044-1: Manufacturer: Panasonic; Part Number: ERJ6ENF2200V
R13 R16 = CMP-1015-00284-2: Manufacturer: Panasonic; Part Number: ERJ-14NF10R0U
R17 R22 R23 = CMP-2000-00956-2: RES SMD 22K OHM 0.1% 1/10W 0603; Temperature Coefficient: 25ppm/°C; Voltage Rating (DC): 75V; Max Power Dissipation: 100mW; Mount: Surface Mount; Length: 1.6mm; Height: 0.45mm; Case/Package: 0603; Depth: 0.8mm; Number of Pins: 2; Width: 0.8mm; Resistance Tolerance: 0.1%; Construction: Rectangular; RoHS Compliant: Yes; Tolerance: 0.1%; Case Code (Metric): 1608; Power Rating: 100mW; Number of Terminations: 2; REACH SVHC: No SVHC; Radiation Hardening: No; Max Operating Temperature: 155°C; Lead Free: Lead Free; Resistor Type: Thin Film; Technology: THIN FILM; Termination: Solder; Packaging: Tape and Reel; Min Operating Temperature: -55°C; Contact Plating: Tin; Voltage Rating: 75V; Military Standard: Not; Series: ERA-3A; Package Quantity: 1; Size Code: 0603; Case Code (Imperial): 0603; Features: Automotive AEC-Q200
R20 R21 = CMP-2000-00804-1: Manufacturer: Panasonic; Part Number: ERJ-3GEYJ513V
S1 S2 = TS21-34-035-BK-160-SMT-TR: Switch; Manufacturer_Name: CUI Devices; Datasheet Link: https://www.cuidevices.com/product/resource/ts21.pdf; Height: 1.7mm; Manufacturer_Part_Number: TS21-34-035-BK-160-SMT-TR; Mouser Part Number: 179-134035BK160SMTTR; Mouser Price/Stock: https://www.mouser.co.uk/ProductDetail/CUI-Devices/TS21-34-035-BK-160-SMT-TR?qs=1Kr7Jg1SGW9zzGN58LP5Sg%3D%3D
SW1 = PTS526SMG20SMTR21_LFS: Switch; Manufacturer_Name: C & K COMPONENTS; Manufacturer_Part_Number: PTS526SMG20SMTR21 LFS; Datasheet Link: https://www.ckswitches.com/media/2780/pts526.pdf; Height: 2.15mm; Mouser Part Number: 611-PTS526SMG20S21LF; Mouser Price/Stock: https://www.mouser.co.uk/ProductDetail/CK/PTS526SMG20SMTR21-LFS?qs=MyNHzdoqoQLOqPcVU%2F1RhA%3D%3D; Arrow Part Number: PTS526SMG20SMTR21 LFS; Arrow Price/Stock: https://www.arrow.com/en/products/pts526smg20smtr21-lfs/ck?region=nac
U3 = CMP-209535-000001-1: LDO Voltage Regulators 1A, 3.3V; Manufacturer: Advanced Monolithic Systems; Dropout Voltage: 1.1V; Output Type: Fixed; Nominal Supply Current: 5mA; Max Power Dissipation: 1.2W; Max Supply Voltage: 15V; Number Of Outputs: 1; Standoff Height: 0.64mm; Max Junction Temp: +125°C; Height: 1.8mm; Package: AMS1117; Device Class L2: Power Management ICs; ComponentLink2Description: Datasheet; ComponentLink2URL: http://www.advanced-monolithic.com/pdf/ds1117.pdf; Category: IC; RoHS: TRUE; Automotive: No; Device Class L1: Integrated Circuits (ICs); Output Current: 1A; Device Class L3: Voltage Regulators - Linear; Temperature: -40°C to +125°C; Output Voltage: 3.3V; Manufacturer Part Number: AMS1117-3.3; Temperature Range Low: -40°C; Octopart: https://octopart.com/ams1117-3.3-advanced+monolithic+systems-25899300; Lead Free: Yes; Ipc Land Pattern Name: SOT229P700X180-4; Temperature Range High: +125°C
U5 = CMP-0314-00263-2: Low-Voltage 16-Bit I2C and SMBus I/O Expander, 16 Outputs, 1.65 to 5.5 V, -40 to 85 degC, 24-pin TSSOP (PW), Green (RoHS & no Sb/Br); Manufacturer: Texas Instruments; Reset Input: Yes; SubFamily: I2C IO Expander; I2C Address: 0100 00x; Max Frequency(kHz): 400; VCC(Min)(V): 1.65; # of I/Os: 16; VCC(Max)(V): 5.5; Mounting Technology: Surface Mount; 5V Tolerant I/O: Yes; ComponentLink1URL: http://www.ti.com/general/docs/lit/getliterature.tsp?genericPartNumber=TCA6416A&fileType=pdf; ComponentLink2URL: http://www.ti.com/litv/pdf/mpds177g; ComponentLink1Description: Datasheet; fSCLK(Max)(MHz): 400; PackageDescription: 24-Pin Thin Small Outline Package 0.65 mm Pitch; DatasheetVersion: SCPS194A; PackageReference: PW0024A; ComponentLink2Description: Package Specification; Interrupt Output: Yes; Eco-Plan: Green (RoHS & no Sb/Br); Configuration Registers: Yes; No. of Outputs: 16; Code_JEDEC: MO-153; PartNumber: TCA6416APWR; Low Power: Yes; Vcc range(V): 1.65 to 5.5; PackageVersion: revG, Feb-2011; Push-Pull I/O Type: Yes